# Altium project Touchscreen PCB.PrjPcb
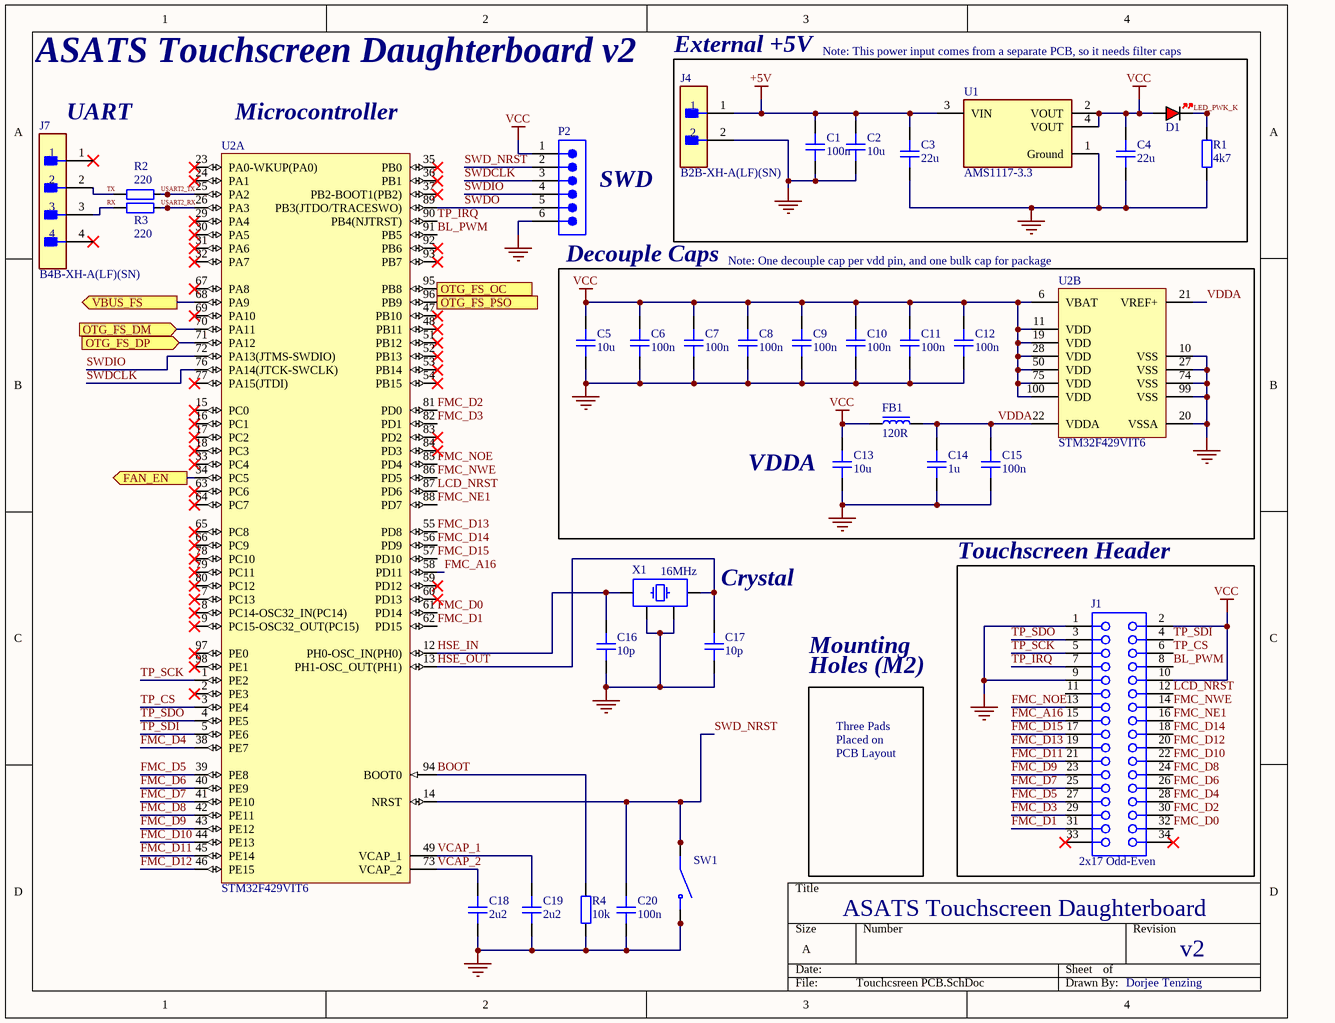
[diagram p0: Touchcsreen PCB.SchDoc]
2 sheets, 49 parts. Net scope: flat (ports and power ports of the same name join across sheets).
Board file: Touchscreen PCB.PcbDoc
Sheets:
  Touchcsreen PCB.SchDoc
  Peripherals.SchDoc

## Sheet Touchcsreen PCB.SchDoc
size A; SheetNumber: 1; SheetTotal: 2

### Parts
C1  100n  [CAP_0402]
C2  10u  [CAP_0603]
C3  22u  [CAP_0805]
C4  22u  [CAP_0805]
C5  10u  [CAP_0603]
C6  100n  [CAP_0402]
C7  100n  [CAP_0402]
C8  100n  [CAP_0402]
C9  100n  [CAP_0402]
C10  100n  [CAP_0402]
C11  100n  [CAP_0402]
C12  100n  [CAP_0402]
C13  10u  [CAP_0603]
C14  1u  [CAP_0402]
C15  100n  [CAP_0402]
C16  10p  [CAP_0402]
C17  10p  [CAP_0402]
C18  2u2  [CAP_0603]
C19  2u2  [CAP_0603]
C20  100n  [CAP_0402]
D1  RED  [LED_0603_RED]  (value not drawn)
FB1  120R  [FB_0603]
J1  2x17 Odd-Even  [SMTC-SSW-117-01-X-D]
J4  B2B-XH-A(LF)(SN)  [FP-B2B-XH-A_LF_SN-MFG]
J7  B4B-XH-A(LF)(SN)  [FP-B4B-XH-A_LF_SN-MFG]
P2  (no value)  [61300611121]
R1  4k7  [RES_0402]
R2  220  [RES_0402]
R3  220  [RES_0402]
R4  10k  [RES_0402]
SW1  (no value)  [SW_TS-1187A-B-A-B]
U1  AMS1117-3.3  [FP-AMS1117-IPC_C]
U2  STM32F429VIT6  [STM-LQFP100_N]  (parts A,B of 2)
X1  16MHz  [XTAL_3225]

### Blocks framed on the sheet
External +5V: C1-C4 D1 J4 R1 U1
Touchscreen Header: J1

### Ports
FAN_EN (out), OTG_FS_DM (in), OTG_FS_DP (in), OTG_FS_OC (in), OTG_FS_PSO (out), VBUS_FS (out)

### Nets
+5V: C1.2 C2.2 C3.2 J4.1 U1.3(VIN)
GND: C1.1 C2.1 C3.1 C4.1 C5.1 C6.1 C7.1 C8.1 C9.1 C10.1 C11.1 C12.1 C13.1 C14.2 C15.1 C16.1 C17.1 C18.1 C19.1 C20.1 J1.1 J1.9 J4.2 P2.6 R1.1 R4.1 SW1.C(NO) SW1.D(NO) U1.1(Ground) U2.10(VSS) U2.20(VSSA) U2.27(VSS) U2.74(VSS) U2.99(VSS) X1.2 X1.4
VCC: C4.2 C5.2 C6.2 C7.2 C8.2 C9.2 C10.2 C11.2 C12.2 C13.2 D1.A FB1.1 J1.2 J1.10 P2.1 U1.2(VOUT) U1.4(VOUT) U2.6(VBAT) U2.11(VDD) U2.19(VDD) U2.28(VDD) U2.50(VDD) U2.75(VDD) U2.100(VDD)
BL_PWM: J1.8 U2.91(PB5)
BOOT: R4.2 U2.94(BOOT0)
FAN_EN: U2.34(PC5) ; port FAN_EN
FMC_A16: J1.15 U2.58(PD11)
FMC_D0: J1.32 U2.61(PD14)
FMC_D1: J1.31 U2.62(PD15)
FMC_D2: J1.30 U2.81(PD0)
FMC_D3: J1.29 U2.82(PD1)
FMC_D4: J1.28 U2.38(PE7)
FMC_D5: J1.27 U2.39(PE8)
FMC_D6: J1.26 U2.40(PE9)
FMC_D7: J1.25 U2.41(PE10)
FMC_D8: J1.24 U2.42(PE11)
FMC_D9: J1.23 U2.43(PE12)
FMC_D10: J1.22 U2.44(PE13)
FMC_D11: J1.21 U2.45(PE14)
FMC_D12: J1.20 U2.46(PE15)
FMC_D13: J1.19 U2.55(PD8)
FMC_D14: J1.18 U2.56(PD9)
FMC_D15: J1.17 U2.57(PD10)
FMC_NE1: J1.16 U2.88(PD7)
FMC_NOE: J1.13 U2.85(PD4)
FMC_NWE: J1.14 U2.86(PD5)
HSE_IN: C16.2 U2.12(PH0-OSC_IN(PH0)) X1.1
HSE_OUT: C17.2 U2.13(PH1-OSC_OUT(PH1)) X1.3
LCD_NRST: J1.12 U2.87(PD6)
LED_PWK_K: D1.K R1.2
OTG_FS_DM: U2.70(PA11) ; port OTG_FS_DM
OTG_FS_DP: U2.71(PA12) ; port OTG_FS_DP
OTG_FS_OC: U2.95(PB8) ; port OTG_FS_OC
OTG_FS_PSO: U2.96(PB9) ; port OTG_FS_PSO
RX: J7.3 R3.1
SWD_NRST: C20.2 P2.2 SW1.A(COM) SW1.B(COM) U2.14(NRST)
SWDCLK: P2.3 U2.76(PA14(JTCK-SWCLK))
SWDIO: P2.4 U2.72(PA13(JTMS-SWDIO))
SWDO: P2.5 U2.89(PB3(JTDO/TRACESWO))
TP_CS: J1.6 U2.3(PE4)
TP_IRQ: J1.7 U2.90(PB4(NJTRST))
TP_SCK: J1.5 U2.1(PE2)
TP_SDI: J1.4 U2.5(PE6)
TP_SDO: J1.3 U2.4(PE5)
TX: J7.2 R2.1
USART2_RX: R3.2 U2.26(PA3)
USART2_TX: R2.2 U2.25(PA2)
VBUS_FS: U2.68(PA9) ; port VBUS_FS
VCAP_1: C19.2 U2.49(VCAP_1)
VCAP_2: C18.2 U2.73(VCAP_2)
VDDA: C14.1 C15.2 FB1.2 U2.21(VREF+) U2.22(VDDA)

Not connected (* = marked no-connect by the designer): J1 11 33* 34*; J7 1* 4*; U2 2(PE3)* 7(PC13)* 8(PC14-OSC32_IN(PC14))* 9(PC15-OSC32_OUT(PC15))* 15(PC0)* 16(PC1)* 17(PC2)* 18(PC3)* 23(PA0-WKUP(PA0))* 24(PA1)* 29(PA4)* 30(PA5)* 31(PA6)* 32(PA7)* 33(PC4)* 35(PB0)* 36(PB1)* 37(PB2-BOOT1(PB2))* 47(PB10)* 48(PB11)* 51(PB12)* 52(PB13)* 53(PB14)* 54(PB15)* 59(PD12)* 60(PD13)* 63(PC6)* 64(PC7)* 65(PC8)* 66(PC9)* 67(PA8)* 69(PA10)* 77(PA15(JTDI))* 78(PC10)* 79(PC11)* 80(PC12)* 83(PD2)* 84(PD3)* 92(PB6)* 93(PB7)* 97(PE0)* 98(PE1)*

### Notes on the sheet
- ASATS Touchscreen Daughterboard v2
- Note: This power input comes from a separate PCB, so it needs filter caps
- (near J7) UART
- (near U2) Microcontroller
- (near P2) SWD
- (near P2) Decouple Caps
- (near U2) Note: One decouple cap per vdd pin, and one bulk cap for package
- (near C13) VDDA
- Crystal
- Mounting
- Holes (M2)
- Three Pads
- Placed on
- PCB Layout
- ASATS Touchscreen Daughterboard
- v2
- Dorjee Tenzing

### Library data of the parts
C1 C6-C12 C15 C20 = CAP_0402: Capacitor SMD 0402; Manufacturer: Samsung Electro-Mechanics; Manufacturer Part Number: CL05B104KO5NNNC; Rating: 16V; Distributor Link: *; LCSC: C1525; Dielectric: *
C2 C5 C13 = CAP_0603: Capacitor SMD 0603; Manufacturer: *Samsung Electro-Mechanics; Manufacturer Part Number: CL10A106MA8NRNC; Rating: 25V; Distributor Link: *; LCSC: C96446; Dielectric: *
C3 C4 = CAP_0805: Capacitor SMD 0805; Manufacturer: Samsung Electro-Mechanics; Manufacturer Part Number: CL21A226MAQNNNE; Rating: 25V; Distributor Link: *; LCSC: C45783; Dielectric: *
C14 = CAP_0402: Capacitor SMD 0402; Manufacturer: Samsung Electro-Mechanics; Manufacturer Part Number: CL05A105KA5NQNC; Rating: 25V; Distributor Link: *; LCSC: C52923; Dielectric: *
C16 C17 = CAP_0402: Capacitor SMD 0402; Manufacturer: Samsung Electro-Mechanics; Manufacturer Part Number: CL05C100JB5NNNC; Rating: 50V; LCSC: C32949; Dielectric: *
C18 C19 = CAP_0603: Capacitor SMD 0603; Manufacturer: Samsung Electro-Mechanics; Manufacturer Part Number: CL10A225KO8NNNC; Rating: 16V; Distributor Link: *; LCSC: C23630; Dielectric: *
D1 = LED_0603_RED: LED 0603 RED SMD; Manufacturer: Hubei KENTO Elec; Manufacturer Part Number: KT-0603R; LCSC: C2286
FB1 = FB_0603: Ferrite Bead SMD 0603; Manufacturer: Murata Electronics; Manufacturer Part Number: BLM18PG121SN1D; Distributor Link: *; LCSC: C14709
J1 = CMP-1023-00453-1: SQ Post Socket, Through-hole, Vertical, -55 to 105 degC, 2.54 mm Pitch, 34-Pin, Female, RoHS; PartNumber: SSW-117-01-T-D; Manufacturer: Samtec; Pitch: 2.54 mm; NotOnBOM: Yes; RoHS: True; ComponentLink3URL: http://www.samtec.com/documents/webfiles/cpdf/SSW-1XX-XX-XXX-X-XX-XXX-XX-MKT.pdf; ComponentLink2Description: Datasheet; Orientation: Vertical; DatasheetVersion: F-214; ComponentLink1Description: Manufacturer URL; ComponentLink3Description: Package Specification; Mounting Technology: Through-hole; Temperature Range: -55 to 105 degC; PackageReference: SSW-117-01-X-D; ComponentLink1URL: http://www.samtec.com; PackageDescription: Assembly, Socket Strip .016 X .031 Tail; PackageVersion: CA, 6/1987; ComponentLink2URL: http://www.samtec.com/documents/webfiles/pdf/SSW_TH.PDF
J4 = CMP-2000-05888-3: CONN HEADER VERT 2POS 2.5MM; Current Rating: 3A; Voltage Rating: 250V; Number of Contacts: 2; Contact Resistance: 20mR; Wire/Cable Gauge: 22AWG; Insulation Resistance: 1GR; Connector Type: Male Pin; Packaging: Bulk; Contact Material: Brass; Lead Free: Lead Free; Orientation: Straight; Contact Plating: Tin; Max Current Rating: 3A; Termination: Solder; Fastening Type: Detent; Depth: 5.75mm; Housing Material: Polyamide; REACH SVHC: No SVHC; Series: XH; Voltage Rating (AC): 250V; Number of Positions: 2; Color: Natural; Contact Type: Male Pin; Max Voltage Rating (DC): 250V; Pitch: 2.5mm; Lead Pitch: 2.5mm; Mount: Through Hole; Max Operating Temperature: 85°C; Length: 7.4mm; Max Voltage Rating (AC): 250V; Min Operating Temperature: -25°C; Number of Rows: 1; Housing Color: White
J7 = CMP-17439-000250-1: CONN HEADER VERT 4POS 2.5MM; Number of Contacts: 4; Contact Resistance: 20mR; Voltage Rating: 250V; Max Current Rating: 3A; Gender: Male; Wire/Cable Gauge: 22AWG; Mated Stacking Heights: 9.8mm; Insulation Resistance: 1GR; Orientation: Straight; Contact Type: Male Pin; Contact Finish - Mating: TIN; Series: XH; Max Voltage Rating (AC): 250V; Lead Pitch: 2.5mm; Contact Shape: Square; Insulation Color: Natural; Termination: Solder; Lead Free: Lead Free; Voltage Rating (AC): 250V; Number of Rows: 1; Flammability Rating: UL94 V-0; Number of Positions: 4; Max Operating Temperature: 85°C; Package Quantity: 500; Mount: Through Hole; REACH SVHC: No SVHC; Connector Type: Header; Insulation Material: Nylon; Fastening Type: Detent; Min Operating Temperature: -25°C; Housing Color: White; Packaging: Bulk; Contact Plating: Tin; Contact Material: Brass; Max Voltage Rating (DC): 250V; Housing Material: Polyamide; Color: Natural; Material: Polyamide; Pitch: 2.5mm; Depth: 5.75mm; Current Rating: 3A; Length: 12.4mm
P2 = CMP-1502-01070-3: NexarPartId: 20084590; Current Rating: 3A; Pitch: 2.54mm; Gender: Male; Operating Supply Voltage: 250V; Connector Type: Male Pin; Number of Positions: 6; Contact Resistance: 20mΩ; NotOnBOM: Yes; Packaging: Bulk; Number of Pins: 6; Number of Rows: 1; Contact Plating: Gold; Lead Free: Lead Free; RoHS: Compliant; Contact Mating Length: 5.9944mm; Voltage Rating: 250V; REACH SVHC: Unknown; Contact Gender: Male; Housing Material: PBT; Min Operating Temperature: -40°C; Lead Pitch: 2.54mm; Mount: Through Hole; Number of Contacts: 6; Max Operating Temperature: 105°C; Contact Material: Copper; Orientation: Vertical; Termination: Through Hole; Color: Black; Height: 8.89mm
R1 = RES_0402: Resistor SMD 0402; Manufacturer: UNI-ROYAL(Uniroyal Elec); Manufacturer Part Number: 0402WGF4701TCE; Distributor Link: *; LCSC: C25900
R2 R3 = RES_0402: Resistor SMD 0402; Manufacturer: UNI-ROYAL(Uniroyal Elec); Manufacturer Part Number: 0402WGF2200TCE; Distributor Link: *; LCSC: C25091
R4 = RES_0402: Resistor SMD 0402; Manufacturer: UNI-ROYAL(Uniroyal Elec); Manufacturer Part Number: 0402WGF1002TCE; Distributor Link: *; LCSC: C25744
SW1 = Push_Button_SW: None Without 50mA 5.1mm 100000 Times 160gf 12V 5.1mm 1.5mm Round Button Standing paste SPST SMD Tactile Switches ROHS; Manufacturer: XKB Connection; Manufacturer Part Number: TS-1187A-B-A-B; LCSC: C318884
U1 = CMP-209535-000001-1: LDO Voltage Regulators 1A, 3.3V; Manufacturer: Advanced Monolithic Systems; Dropout Voltage: 1.1V; Output Type: Fixed; Nominal Supply Current: 5mA; Max Power Dissipation: 1.2W; Max Supply Voltage: 15V; Number Of Outputs: 1; Standoff Height: 0.64mm; Max Junction Temp: +125°C; Height: 1.8mm; Package: AMS1117; Device Class L2: Power Management ICs; ComponentLink2Description: Datasheet; ComponentLink2URL: http://www.advanced-monolithic.com/pdf/ds1117.pdf; Category: IC; RoHS: TRUE; Automotive: No; Device Class L1: Integrated Circuits (ICs); Output Current: 1A; Device Class L3: Voltage Regulators - Linear; Temperature: -40°C to +125°C; Output Voltage: 3.3V; Manufacturer Part Number: AMS1117-3.3; Temperature Range Low: -40°C; Octopart: https://octopart.com/ams1117-3.3-advanced+monolithic+systems-25899300; Lead Free: Yes; Ipc Land Pattern Name: SOT229P700X180-4; Temperature Range High: +125°C; LCSC: C6186
U2 = CMP-0243-00030-2: ARM Cortex-M4 32-bit MCU+FPU, 225 DMIPS, 2048 kB Flash, 256 kB Internal RAM, 82 I/Os, 100-pin LQFP, -40 to 85 degC, Tray; Manufacturer: STMicroelectronics; FLASH Size (Prog) (kB): 2048; Supply Voltage(Vcc) min (V): 1.8; Operating Frequency(F) (Processor speed) (MHz): 180; Supply Voltage(Vcc) max (V): 3.6; D/A Converter: 2x12-bit; Internal RAM Size (kB): 256; I/Os (High Current): 82; Mounting Technology: Surface Mount; ComponentLink3URL: http://www.st.com/st-web-ui/static/active/en/resource/technical/document/data_brief/DM00071938.pdf; ComponentLink2URL: http://www.st.com/st-web-ui/static/active/en/resource/technical/document/data_brief/DM00053488.pdf; ComponentLink3Description: Package Specification; Packing: Tray; PackageDescription: 100-Pin Low Profile Quad Flat Package, 14 x 14 mm Body, 0.5 mm Pitch; PartNumber: STM32F429VIT6; ComponentLink2Description: Datasheet; ComponentLink1Description: Manufacturer URL; ComponentLink1URL: http://www.st.com/web/en/home.html; DatasheetVersion: Rev. 2; Core: ARM Cortex-M4; PackageReference: LQFP100; PackageVersion: Rev. 1, 06/2013; Manufacturer Part Number: STM32F429VIT6; LCSC: C92002
X1 = X3225_16MHZ: Manufacturer: YXC Crystal Oscillators; Manufacturer Part Number: X322516MLB4SI; LCSC: C13738

## Sheet Peripherals.SchDoc
size A; SheetNumber: 2; SheetTotal: 2
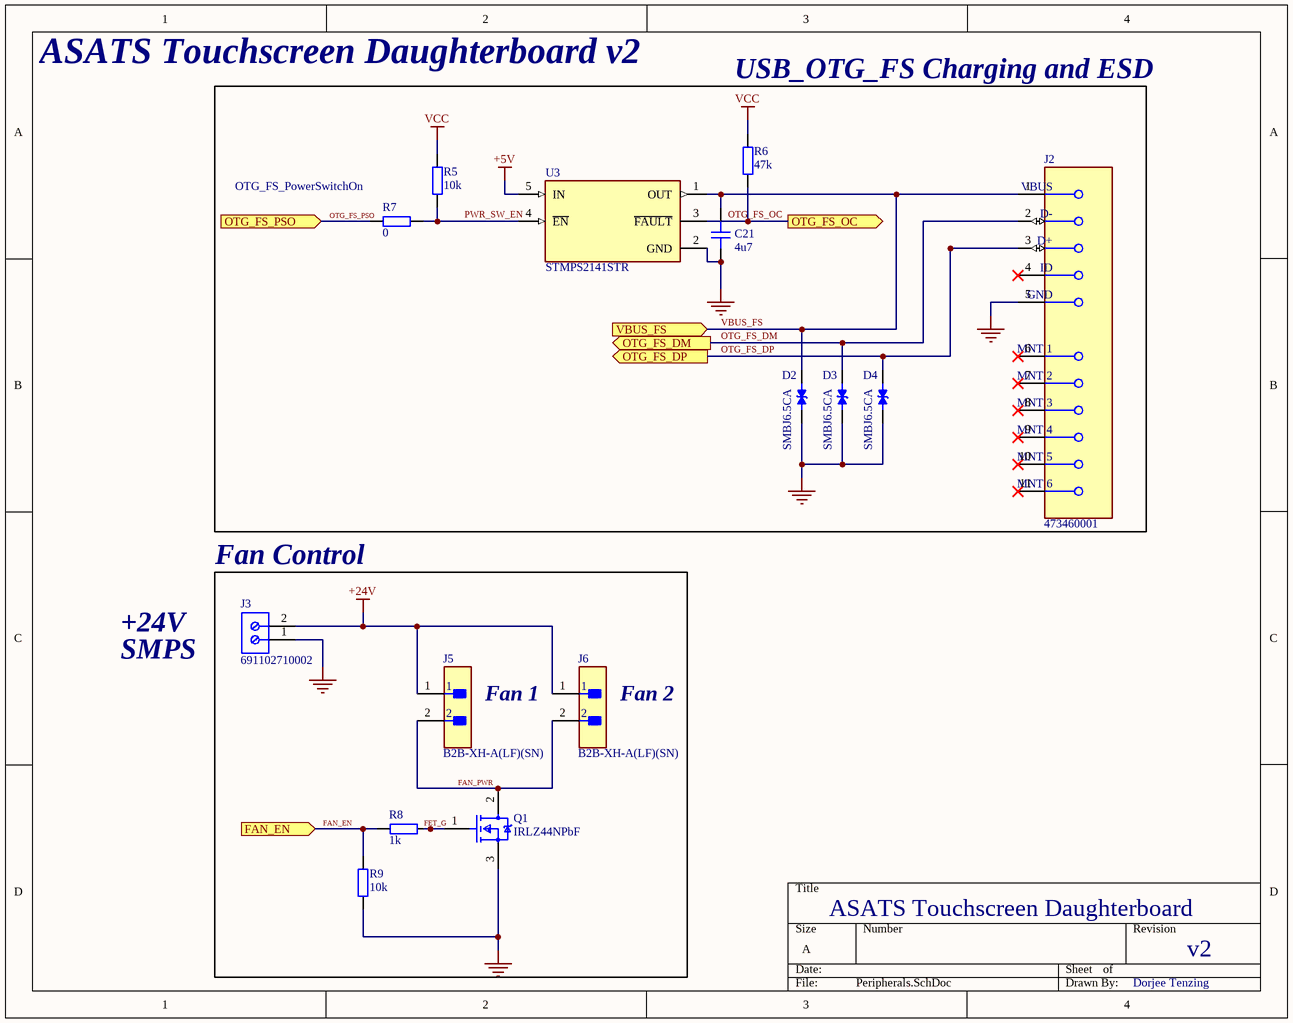
[diagram p1: Peripherals.SchDoc]

### Parts
C21  4u7  [CAP_0603]
D2  SMBJ6.5CA  [DIOM4336X265N]
D3  SMBJ6.5CA  [DIOM4336X265N]
D4  SMBJ6.5CA  [DIOM4336X265N]
J2  473460001  [FP-473460001-MFG]
J3  691102710002  [691102710002]
J5  B2B-XH-A(LF)(SN)  [FP-B2B-XH-A_LF_SN-MFG]
J6  B2B-XH-A(LF)(SN)  [FP-B2B-XH-A_LF_SN-MFG]
Q1  IRLZ44NPbF  [FP-PG-TO220-3-MFG]
R5  10k  [RES_0402]
R6  47k  [RES_0402]
R7  0  [RES_0402]
R8  1k  [RES_0402]
R9  10k  [RES_0402]
U3  STMPS2141STR  [FP-SOT23-5L-MFG]

### Blocks framed on the sheet
USB_OTG_FS Charging and ESD: C21 D2-D4 J2 R5-R7 U3
Fan Control: J3 J5 J6 Q1 R8 R9

### Ports
FAN_EN (in), OTG_FS_DM (out), OTG_FS_DP (out), OTG_FS_OC (out), OTG_FS_PSO (in), VBUS_FS (in)

### Nets
+5V: U3.5(IN)
+24V: J3.2 J5.1 J6.1
GND: C21.1 D2.1 D3.1 D4.1 J2.5(GND) J3.1 Q1.3(S) R9.1 U3.2(GND)
VCC: R5.2 R6.2
FAN_EN: R8.1 R9.2 ; port FAN_EN
FAN_PWR: J5.2 J6.2 Q1.2(D)
FET_G: Q1.1(G) R8.2
OTG_FS_DM: D3.2 J2.2(D-) ; port OTG_FS_DM
OTG_FS_DP: D4.2 J2.3(D+) ; port OTG_FS_DP
OTG_FS_OC: R6.1 U3.3(~{FAULT}) ; port OTG_FS_OC
OTG_FS_PSO: R7.1 ; port OTG_FS_PSO
PWR_SW_EN: R5.1 R7.2 U3.4(~{EN})
VBUS_FS: C21.2 D2.2 J2.1(VBUS) U3.1(OUT) ; port VBUS_FS

Not connected (* = marked no-connect by the designer): J2 4(ID)* 6(MNT_1)* 7(MNT_2)* 8(MNT_3)* 9(MNT_4)* 10(MNT_5)* 11(MNT_6)*

### Notes on the sheet
- ASATS Touchscreen Daughterboard v2
- (near R7) OTG_FS_PowerSwitchOn
- +24V
- SMPS
- Fan 1
- (near J6) Fan 2
- ASATS Touchscreen Daughterboard
- v2
- Dorjee Tenzing

### Library data of the parts
C21 = CAP_0603: Capacitor SMD 0603; Manufacturer: Samsung Electro-Mechanics; Manufacturer Part Number: CL10A475KO8NNNC; Rating: 16V; Distributor Link: *; LCSC: C19666; Dielectric: *
D2-D4 = SMBJ6.5CA: 53.57A 600W 11.2V 7.22V Bidirectional 6.5V SMB  ESD and Surge Protection (TVS/ESD) ROHS; Manufacturer: hongjiacheng; Manufacturer Part Number: SMBJ6.5CA; LCSC: C7420377
J2 = CMP-2000-05246-2: CONN RCPT USB2.0 MICRO B SMD R/A; Manufacturer: Molex; Conn Orientation: Right Angle; Is Female: yes; Shielding: true; Pitch: 0.65mm; Number Of Contacts: 5; Voltage Rating: 30V; Current Rating: 1.8A; Device Class L2: USB Connectors; Digikey Description: CONN RCPT USB2.0 MICRO B SMD R/A; Height: 2.945mm; RoHS: TRUE; ComponentLink2Description: Datasheet; Octopart: https://octopart.com/47346-0001-molex-7164928; Automotive: No; Package: 0; Category: Conn; Device Class L1: Connectors; Usb Standard: USB 2.0; Temperature: -30°C to +85°C; Temperature Range Low: -30°C; Footprint Url: https://www.molex.com/pdm_docs/sd/473460001_sd.pdf; ComponentLink2URL: https://www.molex.com/webdocs/datasheets/pdf/en-us/0473460001_IO_CONNECTORS.pdf; Lead Free: Yes; Manufacturer Part Number: 473460001; Contact Material: Gold,Nickel; Temperature Range High: +85°C; Device Class L3: unset; LCSC: C132560
J3 = CMP-1502-03258-2: NexarPartId: 8917706; Number of Levels: 1; Number of Positions Per Level: 2; Current: 15A; Voltage: 300V; Pitch: 5.0038mm; Plating: Steel; Stripping Length: -6mm; Wire Gauge (Min): 14AWG; Wire Gauge (Max): 22AWG; Length: 7.5mm; Contact Material: Brass; Contact Plating: Tin; Packaging: Box; Number of Pins: 2; Voltage Rating: 300V; Termination: Screw; Number of Contacts: 2; Color: Blue; Current Rating: 15A; Mount: Through Hole; Max Operating Temperature: 105°C; Min Operating Temperature: -40°C; REACH SVHC: Unknown; Height: 13.4mm; Width: 11.2mm; Housing Material: Nylon; RoHS: Compliant; Wire/Cable Gauge: 22AWG; Lead Pitch: 5mm
J5 J6 = CMP-2000-05888-3: as J4 on sheet Touchcsreen PCB; Packaging: Bulk; Contact Material: Brass; Lead Free: Lead Free; Orientation: Straight; Contact Plating: Tin; Max Current Rating: 3A; Termination: Solder; Fastening Type: Detent; Depth: 5.75mm; Housing Material: Polyamide; REACH SVHC: No SVHC; Series: XH; Voltage Rating (AC): 250V; Number of Positions: 2; Color: Natural; Contact Type: Male Pin; Max Voltage Rating (DC): 250V; Pitch: 2.5mm; Lead Pitch: 2.5mm; Mount: Through Hole; Max Operating Temperature: 85°C; Length: 7.4mm; Max Voltage Rating (AC): 250V; Min Operating Temperature: -25°C; Number of Rows: 1; Housing Color: White
Q1 = CMP-32901-000488-1: MOSFET N-CH 55V 47A TO220AB; Turn-On Delay Time: 11ns; Gate to Source Voltage (Vgs): 16V; Element Configuration: Single; Rds On Max: 22mR; Turn-Off Delay Time: 26ns; Max Power Dissipation: 110W; Threshold Voltage: 2V; Drain to Source Resistance: 35mR; Input Capacitance: 1.7nF; Continuous Drain Current (ID): 47A; Case/Package: TO-220; Lead Free: Lead Free; Halogen Free: Halogen Free; Packaging: Rail/Tube; Length: 0.414inch; Min Operating Temperature: -55°C; REACH SVHC: No SVHC; Number of Pins: 3; Width: 0.185inch; Drain to Source Voltage (Vdss): 55V; Power Dissipation: 110W; RoHS Compliant: Yes; Max Operating Temperature: 175°C; Height: 0.6inch; Max Dual Supply Voltage: 55V; Drain to Source Breakdown Voltage: 55V; Mount: Through Hole
R5 R9 = RES_0402: as R4 on sheet Touchcsreen PCB; Distributor Link: *; LCSC: C25744
R6 = RES_0402: Resistor SMD 0402; Manufacturer: UNI-ROYAL(Uniroyal Elec); Manufacturer Part Number: 0402WGF4702TCE; Distributor Link: *; LCSC: C25792
R7 = RES_0402: Resistor SMD 0402; Manufacturer: UNI-ROYAL(Uniroyal Elec); Manufacturer Part Number: 0402WGF0000TCE; Distributor Link: *; LCSC: C17168
R8 = RES_0402: Resistor SMD 0402; Manufacturer: UNI-ROYAL(Uniroyal Elec); Manufacturer Part Number: 0402WGF1001TCE; Distributor Link: *; LCSC: C11702
U3 = CMP-00355-07169648-1: STMPS2141STR STMPS Series 1 Channel 5.5 V 500 mA 200 mOhm High Side Power Switch - SOT-23-5; Manufacturer: STMicroelectronics; Max Junction Temperature (Tj): 125°C; Output Current: 0A; Voltage: 5.5V; Interface: On/Off; Nominal Input Voltage: 5V; Current Rating: 500mA; Drain to Source Resistance: 90mΩ; Turn-Off Delay Time: 10ms; Number of Outputs: 1; Fault Protection: Over Temperature, Reverse Current; Nominal Supply Current: 40µA; Power Dissipation: 32.5mW; Resistance: 120mΩ; Turn-On Delay Time: 5ms; Min Input Voltage: 2.7V; Radiation Hardening: No; Output Configuration: High Side; Length: 3mm; Packaging: Tape & Reel (TR); Lifecycle Status: Production; Max Input Voltage: 5.5V; Number of Inputs: 1; Max Supply Voltage: 5.5V; Max Operating Temperature: 85°C; Ambient Temperature Range High: 85°C; Min Operating Temperature: -40°C; Operating Supply Voltage: 5.5V; RoHS: Compliant; Width: 1.75mm; Max Power Dissipation: 32.5mW; Number of Channels: 1; Output Voltage: 5V; Mount: Surface Mount; Case/Package: SOT-23-5; Max Supply Current: 40µA; NexarPartId: 7169648; Min Supply Voltage: 2.7V; Number of Pins: 5; Current: 500mA; Lead Free: Lead Free; Max Output Current: 500mA; Height: 1.3mm; Schedule B: 8542390000; Manufacturer Part Number: STMPS2141STR; LCSC: C54624

## Nets that join several sheets
+5V: Touchcsreen PCB (5 pins), Peripherals (U3.5)
GND: Touchcsreen PCB (36 pins), Peripherals (9 pins)
VCC: Touchcsreen PCB (24 pins), Peripherals (R5.2 R6.2)
FAN_EN: Touchcsreen PCB (U2.34), Peripherals (R8.1 R9.2)
OTG_FS_DM: Touchcsreen PCB (U2.70), Peripherals (D3.2 J2.2)
OTG_FS_DP: Touchcsreen PCB (U2.71), Peripherals (D4.2 J2.3)
OTG_FS_OC: Touchcsreen PCB (U2.95), Peripherals (R6.1 U3.3)
OTG_FS_PSO: Touchcsreen PCB (U2.96), Peripherals (R7.1)
VBUS_FS: Touchcsreen PCB (U2.68), Peripherals (C21.2 D2.2 J2.1 U3.1)